# Altium schematic sheet POWER.SchDoc
size A3; SheetNumber: 3; SheetTotal: 6; SPICEModelCacheVNVTNIMV: <root> / <DocumentId>VNVTNIMV</DocumentId> / </root>
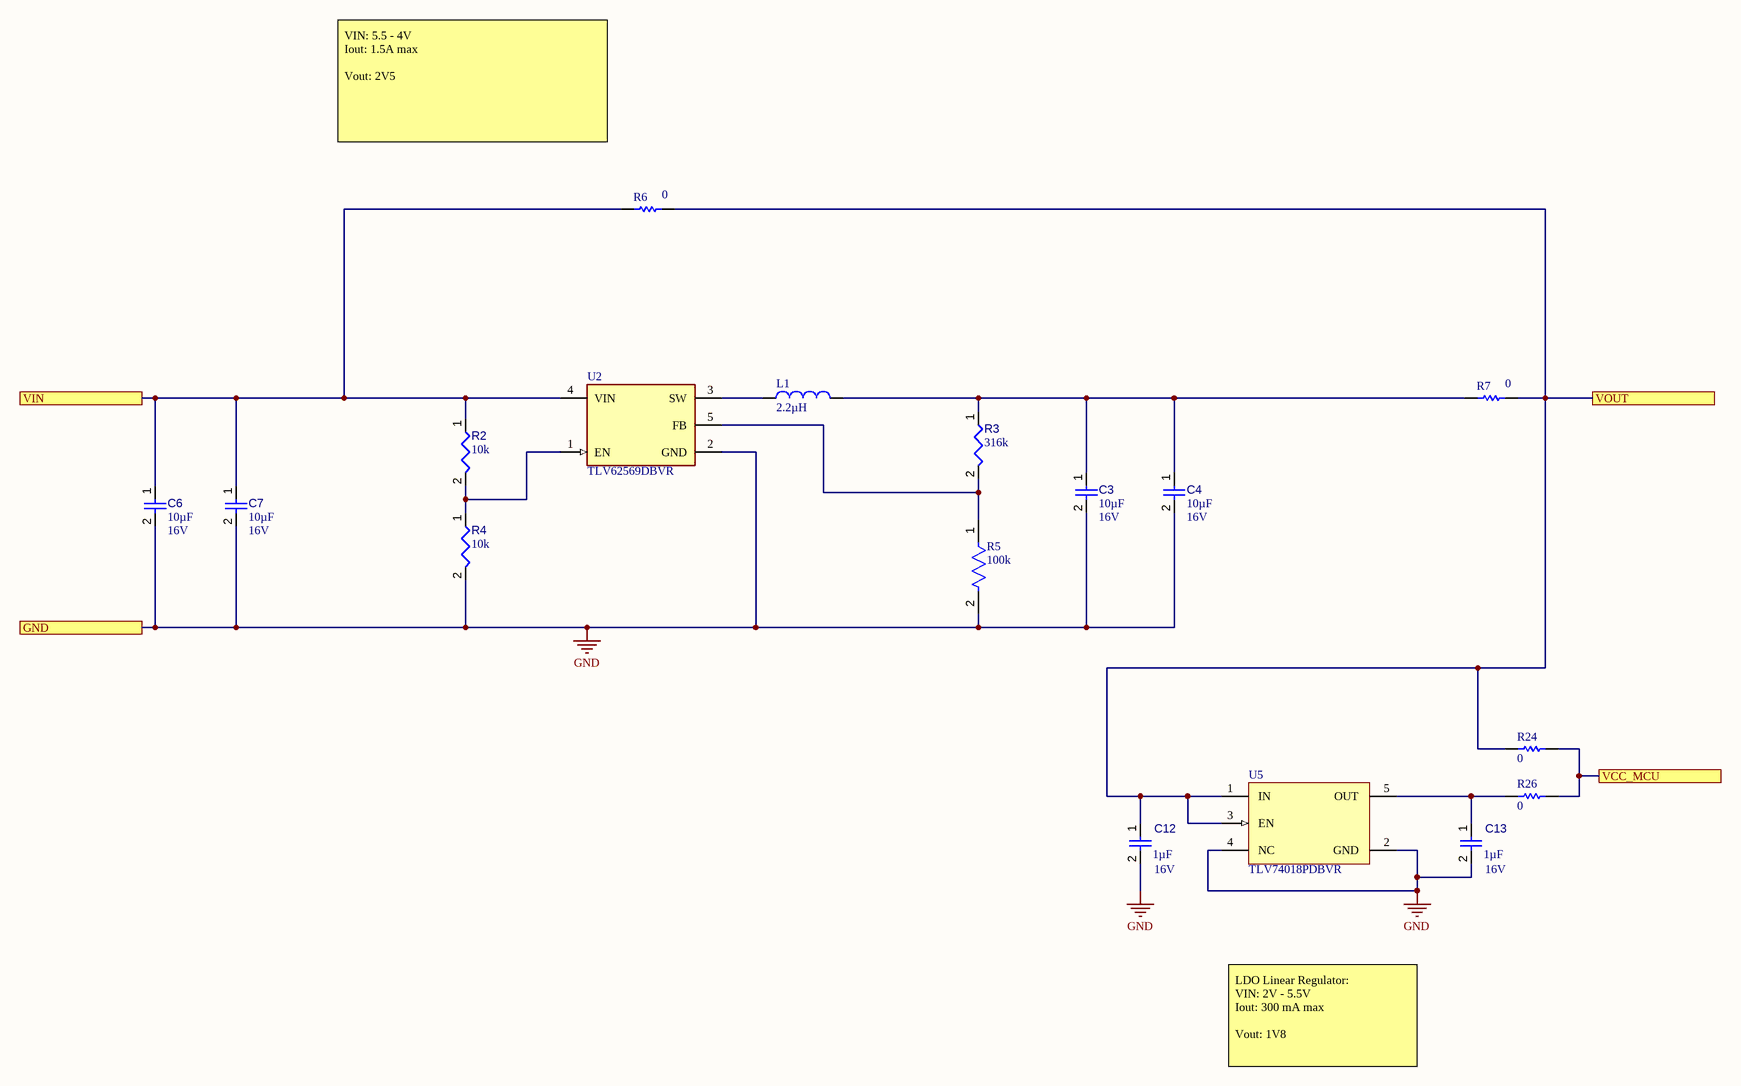
[diagram p0: POWER.SchDoc]

## Parts
C3  value 10µF  Voltage Rating: 16V  [CAPC1608X09N]  (hidden comment: CL10A106MO8NQNC)
C4  value 10µF  Voltage Rating: 16V  [CAPC1608X09N]  (hidden comment: CL10A106MO8NQNC)
C6  value 10µF  Voltage Rating: 16V  [CAPC1608X09N]  (hidden comment: CL10A106MO8NQNC)
C7  value 10µF  Voltage Rating: 16V  [CAPC1608X09N]  (hidden comment: CL10A106MO8NQNC)
C12  value 1µF  Voltage Rating: 16V  [CAPC1005X55X25ML05T10]  (hidden comment: Capacitor 1 uF +/- 10% 16V 0402)
C13  value 1µF  Voltage Rating: 16V  [CAPC1005X55X25ML05T10]  (hidden comment: Capacitor 1 uF +/- 10% 16V 0402)
L1  value 2.2µH  [INDC5050X40N]  (hidden comment: CMLW5040S2R2MST)
R2  value 10k  [RESC0402(1005)_L]  (hidden comment: Resistor 10K  +/-1 % 0402 63 mW)
R3  value 316k  [RESC0402(1005)_L]  (hidden comment: Resistor 316K +/-1 % 0402 63 mW)
R4  value 10k  [RESC0402(1005)_L]  (hidden comment: Resistor 10K  +/-1 % 0402 63 mW)
R5  Resistance: 100k  [FP-CRCW0402-e3-IPC_C]  (hidden comment: CRCW0402100KFKED)
R6  value 0  [RESC2013X50X35ML15T15]  (hidden comment: Resistor 0R +/- 1% 0805 125 mW)
R7  value 0  [RESC2013X50X35ML15T15]  (hidden comment: Resistor 0R +/- 1% 0805 125 mW)
R24  value 0  [RESC1608X55X25ML10T15]  (hidden comment: Resistor 0R +/- 5% 0603 100 mW)
R26  value 0  [RESC1608X55X25ML10T15]  (hidden comment: Resistor 0R +/- 5% 0603 100 mW)
U2  TLV62569DBVR  [FP-DBV0005A-IPC_B]
U5  TLV74018PDBVR  [DBV0005A_MFG]

## Ports
GND, VCC_MCU, VIN, VOUT

## Nets
GND: C3.2 C4.2 C6.2 C7.2 C12.2 C13.2 R4.2 R5.2 U2.2(GND) U5.2(GND) U5.4(NC) ; port GND
VCC_MCU: R24.2 R26.2 ; port VCC_MCU
VIN: C6.1 C7.1 R2.1 R6.1 U2.4(VIN) ; port VIN
VOUT: C12.1 R6.2 R7.2 R24.1 U5.1(IN) U5.3(EN) ; port VOUT
NetC3_1: C3.1 C4.1 L1.2 R3.1 R7.1
NetC13_1: C13.1 R26.1 U5.5(OUT)
NetL1_1: L1.1 U2.3(SW)
NetR2_2: R2.2 R4.1 U2.1(EN)
NetR3_2: R3.2 R5.1 U2.5(FB)

## Notes on the sheet
- VIN: 5.5 - 4V
  Iout: 1.5A max
  Vout: 2V5
- LDO Linear Regulator:
  VIN: 2V - 5.5V
  Iout: 300 mA max
  Vout: 1V8
- Sheet Title
- PCB Project Name
- Modified
- Sheet
- of

## Library data of the parts
C3 C4 C6 C7 = CMP-001-00088-2: Ceramic Capacitor, Multilayer, Ceramic, 16V, 20% +Tol, 20% -Tol, X5R, 15% TC, 10uF, Surface Mount, 0603; Manufacturer 1: Samsung; Manufacturer Lifecycle 1: Unknown; RoHS Compliant: Yes; Min Operating Temperature: -55°C; Manufacturer Part Number 1: CL10A106MO8NQNC; Case/Package: 0603; Supplier 1: LCSC; Supplier Unit Price 1: .007; Capacitor Type: Ceramic; Supplier Part Number 1: C92487; Max Operating Temperature: 85°C; Pins: 2; Mounting Technology: Surface Mount
C12 C13 = CMP-001-00084-3: Chip Capacitor, 1 uF, +/- 10%, 16V, 0402 (1005 Metric); Manufacturer 1: Taiyo Yuden; Manufacturer Lifecycle 1: Unknown; Manufacturer Part Number 1: EMK105BJ105KV-F; Capacitor Type: Ceramic; Case/Package: 0402; Tolerance: 10%; Pins: 2; RoHS Compliant: Yes; Min Operating Temperature: -55°C; Max Operating Temperature: 85°C; Mounting Technology: Surface Mount; Supplier 1: LCSC; Supplier Unit Price 1: .0034; Supplier Part Number 1: C92755
L1 = CMP-006-00022-1: Shielded wirewound inductor, 2.2uH, 20%, 3.95A, 17 mohm DCR; Manufacturer 1: Cybermax; Manufacturer Lifecycle 1: Unknown; Supplier Part Number 1: CMLW5040S2R2MST; Case/Package: SMD; Supplier Unit Price 1: .034; Min Operating Temperature: 125°C; Pins: 2; Supplier 1: LCSC; Tolerance: 20%; Manufacturer Part Number 1: CMLW5040S2R2MST; Max Operating Temperature: -40°C
R2 R4 = CMP-009-00149-2: Chip Resistor, 10 kOhms, +/-1 %, 63 mW, -55 to 125 degC, 0402; Power: 63mW; Tolerance: 1%; Pins: 2; Max Operating Temperature: 155°C; Min Operating Temperature: -55°C; Case/Package: 0402
R3 = CMP-009-00142-2: Chip Resistor, 316 kOhms, +/-1 %, 63 mW, -55 to 155 degC, 0402; Power: 63mW; Tolerance: 1%; Max Operating Temperature: 155°C; Pins: 2; Min Operating Temperature: -55°C; Case/Package: 0402
R5 = CMP-2002-08123-3: RES Thick Film, 100kΩ, 1%, 0.063W, 100ppm/°C, 0402; Power Rating: 63mW; Voltage Rating (DC): 50V; Lead Free: Lead Free; Height: 0.35mm; Contact Plating: Tin; Min Operating Temperature: -55°C; Package Quantity: 10000; Case/Package: 0402; Temperature Coefficient: 100ppm/°C; Number of Terminations: 2; Packaging: Tape and Reel; Max Power Dissipation: 63mW; Case Code (Metric): 1005; Mount: Surface Mount; Width: 0.02inch; Termination: SMD/SMT; Length: 1mm; Number of Pins: 2; Weight: 2.3E-05oz; Radiation Hardening: No; Tolerance: 1%; Military Standard: Not; Features: Automotive AEC-Q200; Depth: 0.5mm; Composition: Thick Film; Max Operating Temperature: 155°C; Voltage Rating: 50V; Case Code (Imperial): 0402
R6 R7 = CMP-009-00001-4: Chip Resistor, 0 Ohm, +/- 1%, 125 mW, -55 to 155 degC, 0805 (2012 Metric); Power: 125mW; Voltage Rating: 150V; Tolerance: 1%; Mounting Technology: SM; Min Operating Temperature: -55°C; Case/Package: 0805; Pins: 2; Max Operating Temperature: 155°C; RoHS Compliant: True
R24 R26 = CMP-009-00006-4: Chip Resistor, 0 Ohm, 0.1 W, -55 to 155 degC, 0603 (1608 Metric); Power: 100mW; Voltage Rating: 50V; Pins: 2; Mounting Technology: SM; Case/Package: 0603; Max Operating Temperature: 155°C; RoHS Compliant: True; Min Operating Temperature: -55°C; Tolerance: 5%
U2 = CMP-019-00051-1: Switching Regulator, 2A, 1500kHz Switching Freq-Max, PDSO5; Max Supply Voltage: 5.5V; Max Operating Temperature: 125°C; Min Operating Temperature: -40°C; RoHS Compliant: Yes; Case/Package: LSSOP; Pins: 5
U5 = CMP-019-00052-1: IC REG LINEAR 1.8V 300MA SOT23-5; Manufacturer 1: TI; Manufacturer Lifecycle 1: Unknown; Case/Package: SOT23-5; Supplier 1: Digikey; RoHS Compliant: Yes; Manufacturer Part Number 1: TLV74018PDBVR; Supplier Part Number 1: 296-TLV74018PDBVRCT-ND; Supplier Unit Price 1: .030